# Altium schematic sheet diff_probe_top.SchDoc
size A4; SheetNumber: 1; SheetTotal: 2
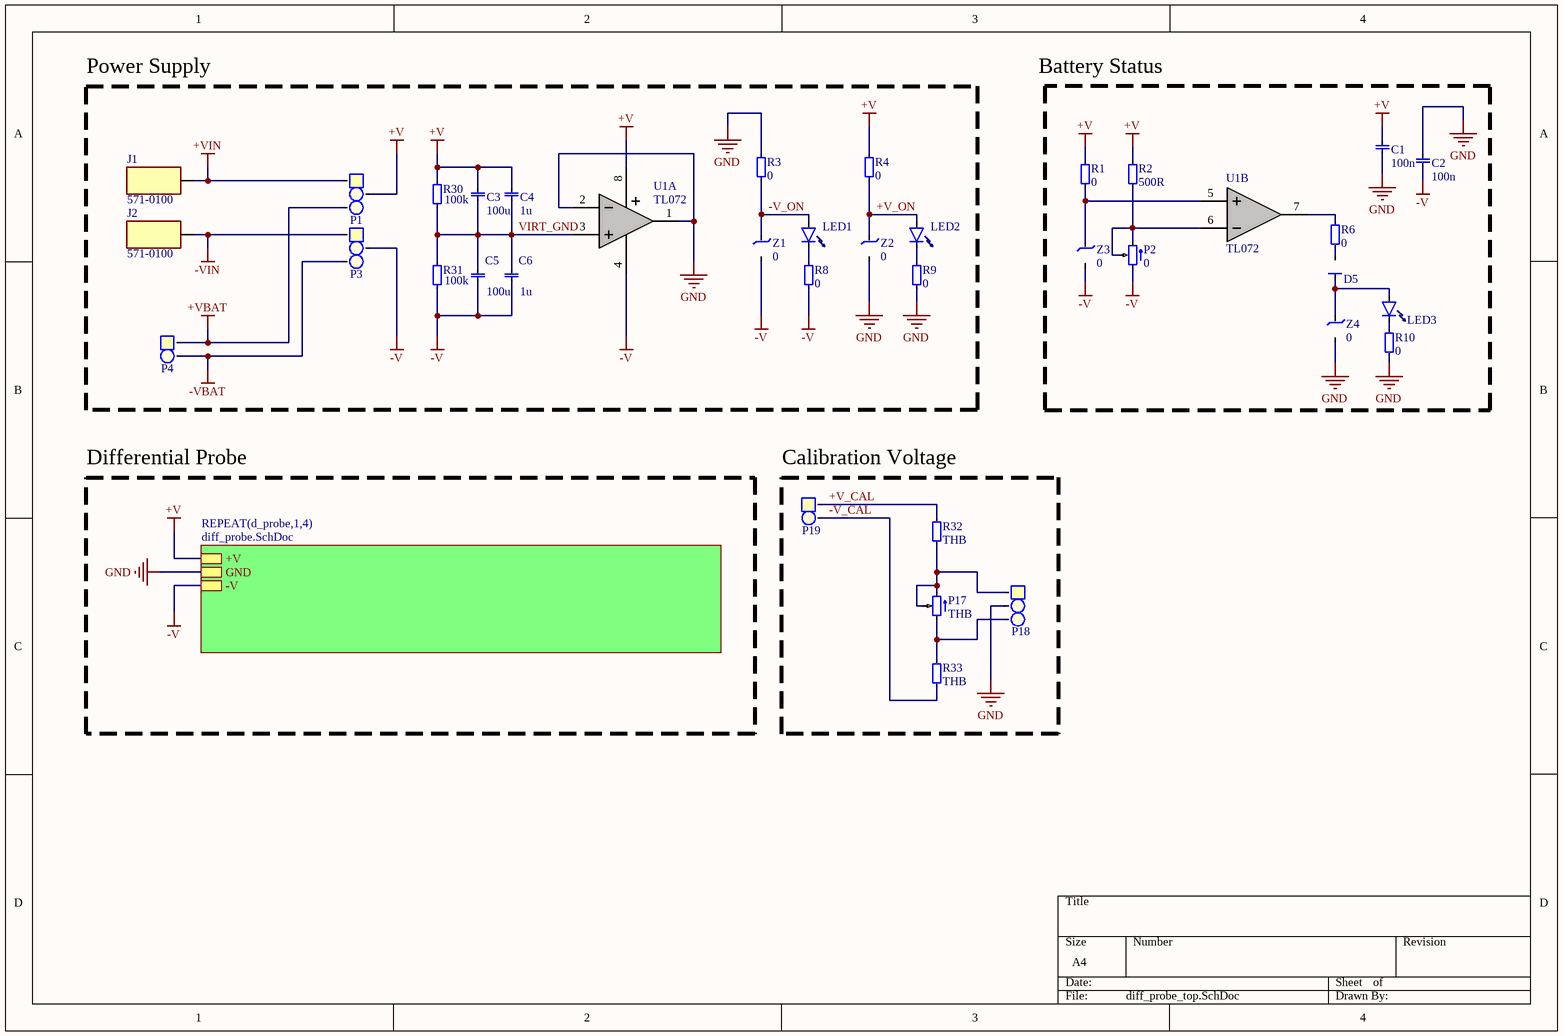
[diagram p0: diff_probe_top.SchDoc]

## Parts
C1  value 100n  [0603 cap]  (hidden comment: 0603, capacitor)
C2  value 100n  [0603 cap]  (hidden comment: 0603, capacitor)
C3  value 100u  [1206, capasitor]  (hidden comment: 1206, capacitor)
C4  value 1u  [1206, capasitor]  (hidden comment: 1206, capacitor)
C5  value 100u  [1206, capasitor]  (hidden comment: 1206, capacitor)
C6  value 1u  [1206, capasitor]  (hidden comment: 1206, capacitor)
D5  Diode, SMD  [SOD323]  (value not drawn)
J1  571-0100  [Banana Conn VCC]
J2  571-0100  [Banana Conn GND]
LED1  0805, LED  [0805_led]  (value not drawn)
LED2  0805, LED  [0805_led]  (value not drawn)
LED3  0805, LED  [0805_led]  (value not drawn)
P1  1x3 Pin Header Mux  [padThree_L]  (value not drawn)
P2  value 0  [PV36W104C01B00]  (hidden comment: Pot)
P3  1x3 Pin Header Mux  [padThree_L]  (value not drawn)
P4  1x2 Pin Header  [padtwo_L]  (value not drawn)
P17  value THB  [PV36W104C01B00]  (hidden comment: Pot)
P18  1x3 Pin Header  [1x3_horizontal]  (value not drawn)
P19  1x2 Pin Header  [1x2 Bent]  (value not drawn)
R1  value 0  [0603]  (hidden comment: 0603, resistor)
R2  value 500R  [0603]  (hidden comment: 0603, resistor)
R3  value 0  [0603]  (hidden comment: 0603, resistor)
R4  value 0  [0603]  (hidden comment: 0603, resistor)
R6  value 0  [0603]  (hidden comment: 0603, resistor)
R8  value 0  [0603]  (hidden comment: 0603, resistor)
R9  value 0  [0603]  (hidden comment: 0603, resistor)
R10  value 0  [0603]  (hidden comment: 0603, resistor)
R30  value 100k  [0603]  (hidden comment: 0603, resistor)
R31  value 100k  [0603]  (hidden comment: 0603, resistor)
R32  value THB  [0603]  (hidden comment: 0603, resistor)
R33  value THB  [0603]  (hidden comment: 0603, resistor)
U1  TL072  [SOIC8]  (parts A,B of 2)
Z1  value 0  [DO-214AA]  (hidden comment: Zener Diode)
Z2  value 0  [DO-214AA]  (hidden comment: Zener Diode)
Z3  value 0  [DO-214AA]  (hidden comment: Zener Diode)
Z4  value 0  [DO-214AA]  (hidden comment: Zener Diode)

## Blocks framed on the sheet
Power Supply: C3-C6 J1 J2 LED1 LED2 P1 P3 P4 R3 R4 R8 R9 R30 R31 U1 Z1 Z2
Calibration Voltage: P17-P19 R32 R33

## Sub-sheets
REPEAT(d_probe,1,4) = diff_probe.SchDoc: GND, +V, -V

## Nets
+V: C1.1 C3.1 C4.1 P1.2 R1.0 R2.1 R4.0 R30.0 U1.8(V+) ; sheet REPEAT(d_probe,1,4)/+V
+VBAT: P1.3 P4.1
+VIN: J1.1 P1.1
-V: C2.1 C5.0 C6.0 P2.1 P3.2 R8.1 R31.1 U1.4(V-) Z1.1(Anode) Z3.1(Anode) ; sheet REPEAT(d_probe,1,4)/-V
-VBAT: P3.3 P4.2
-VIN: J2.1 P3.1
GND: C1.0 C2.0 P18.2 R3.0 R9.1 R10.1 U1.1(OUT1) U1.2(IN-) Z2.1(Anode) Z4.1(Anode) ; sheet REPEAT(d_probe,1,4)/GND
+V_CAL: P19.1 R32.0
+V_ON: LED2.1 R4.1 Z2.2(Cathode)
-V_CAL: P19.2 R33.1
-V_ON: LED1.1 R3.1 Z1.2(Cathode)
VIRT_GND: C3.0 C4.0 C5.1 C6.1 R30.1 R31.0 U1.3(IN+)
NetD5_1: D5.1 LED3.1 Z4.2(Cathode)
NetD5_2: D5.2 R6.1
NetLED1_0: LED1.0(Cathode) R8.0
NetLED2_0: LED2.0(Cathode) R9.0
NetLED3_0: LED3.0(Cathode) R10.0
NetP2_2: P2.2 P2.3 R2.0 U1.6(IN-)
NetP17_1: P17.1 P18.3 R33.0
NetP17_2: P17.2 P17.3 P18.1 R32.1
NetR1_1: R1.1 U1.5(IN+) Z3.2(Cathode)
NetR6_0: R6.0 U1.7(OUT2)

## Notes on the sheet
- Battery Status
- Differential Probe

## Library data of the parts
J1 J2 = Banana conn: Banana Connector 571-0100; Manufacturer_Name: Deltron; Datasheet Link: https://www.dem-uk.com/deltron-components/Data/Product_Downloads/deltron-571-0100-4mm-90deg-single-socket-data.pdf; Height: 12.4mm; Manufacturer_Part_Number: 571-0100; Mouser Part Number: 164-6218; Mouser Price/Stock: https://www.mouser.com/Search/Refine.aspx?Keyword=164-6218
LED1-LED3 = 0805, LED: Value: 0805 LED
P1 P3 = 1x3 Pin Header Mux: 2.54 mm; Value: 1x3 Pin Header
P4 P19 = 1x2 Pin Header: 2.54 mm, TH; Value: 1x2 Pin Header
P18 = 1x3 Pin Header: 2.54 mm; Value: 1x3 Pin Header
U1 = TL072: Dual FET-Input Operational Amplifier
C1 C2 = 0603, capacitor: Order number: *